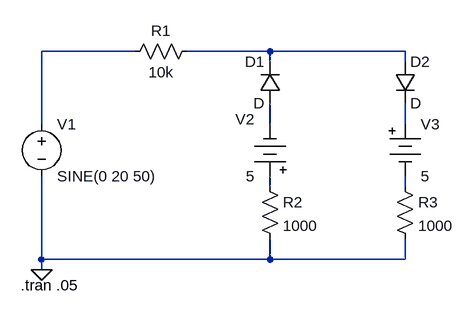
[diagram p0: schematic Diodo - Limitador_Diodo_Comum_Fonte_Resistor.asc]
Diodo - Limitador_Diodo_Comum_Fonte_Resistor.asc, the LTspice schematic file:
Version 4
SHEET 1 880 680
WIRE 144 80 0 80
WIRE 352 80 224 80
WIRE 560 80 352 80
WIRE 352 96 352 80
WIRE 560 96 560 80
WIRE 0 192 0 80
WIRE 352 192 352 160
WIRE 560 192 560 160
WIRE 352 288 352 272
WIRE 560 288 560 272
WIRE 0 400 0 272
WIRE 352 400 352 368
WIRE 352 400 0 400
WIRE 560 400 560 368
WIRE 560 400 352 400
WIRE 0 416 0 400
FLAG 0 416 0
SYMBOL voltage 0 176 R0
SYMATTR InstName V1
SYMATTR Value SINE(0 20 50)
SYMBOL res 128 96 R270
WINDOW 0 32 56 VTop 2
WINDOW 3 0 56 VBottom 2
SYMATTR InstName R1
SYMATTR Value 10k
SYMBOL res 336 272 R0
SYMATTR InstName R2
SYMATTR Value 1000
SYMBOL res 544 272 R0
SYMATTR InstName R3
SYMATTR Value 1000
SYMBOL diode 368 160 R180
WINDOW 0 24 64 Left 2
WINDOW 3 24 0 Left 2
SYMATTR InstName D1
SYMBOL diode 544 96 R0
SYMATTR InstName D2
SYMBOL Misc\\battery 352 288 R180
WINDOW 0 24 104 Left 2
WINDOW 3 24 16 Left 2
WINDOW 123 0 0 Left 2
WINDOW 39 0 0 Left 2
SYMATTR InstName V2
SYMATTR Value 5
SYMBOL Misc\\battery 560 176 R0
WINDOW 123 0 0 Left 2
WINDOW 39 0 0 Left 2
SYMATTR InstName V3
SYMATTR Value 5
TEXT -32 440 Left 2 !.tran .05

The netlist it stands for:
* Diodo - Limitador_Diodo_Comum_Fonte_Resistor.asc
V1 N001 0 SINE(0 20 50)
R1 N001 N002 10k
R2 N005 0 1000
R3 N006 0 1000
D1 N003 N002 D
D2 N002 N004 D
V2 N005 N003 5
V3 N004 N006 5
.model D D
.lib standard.dio
.tran .05
.backanno
.end